# Altium schematic sheet device.SchDoc
size A2
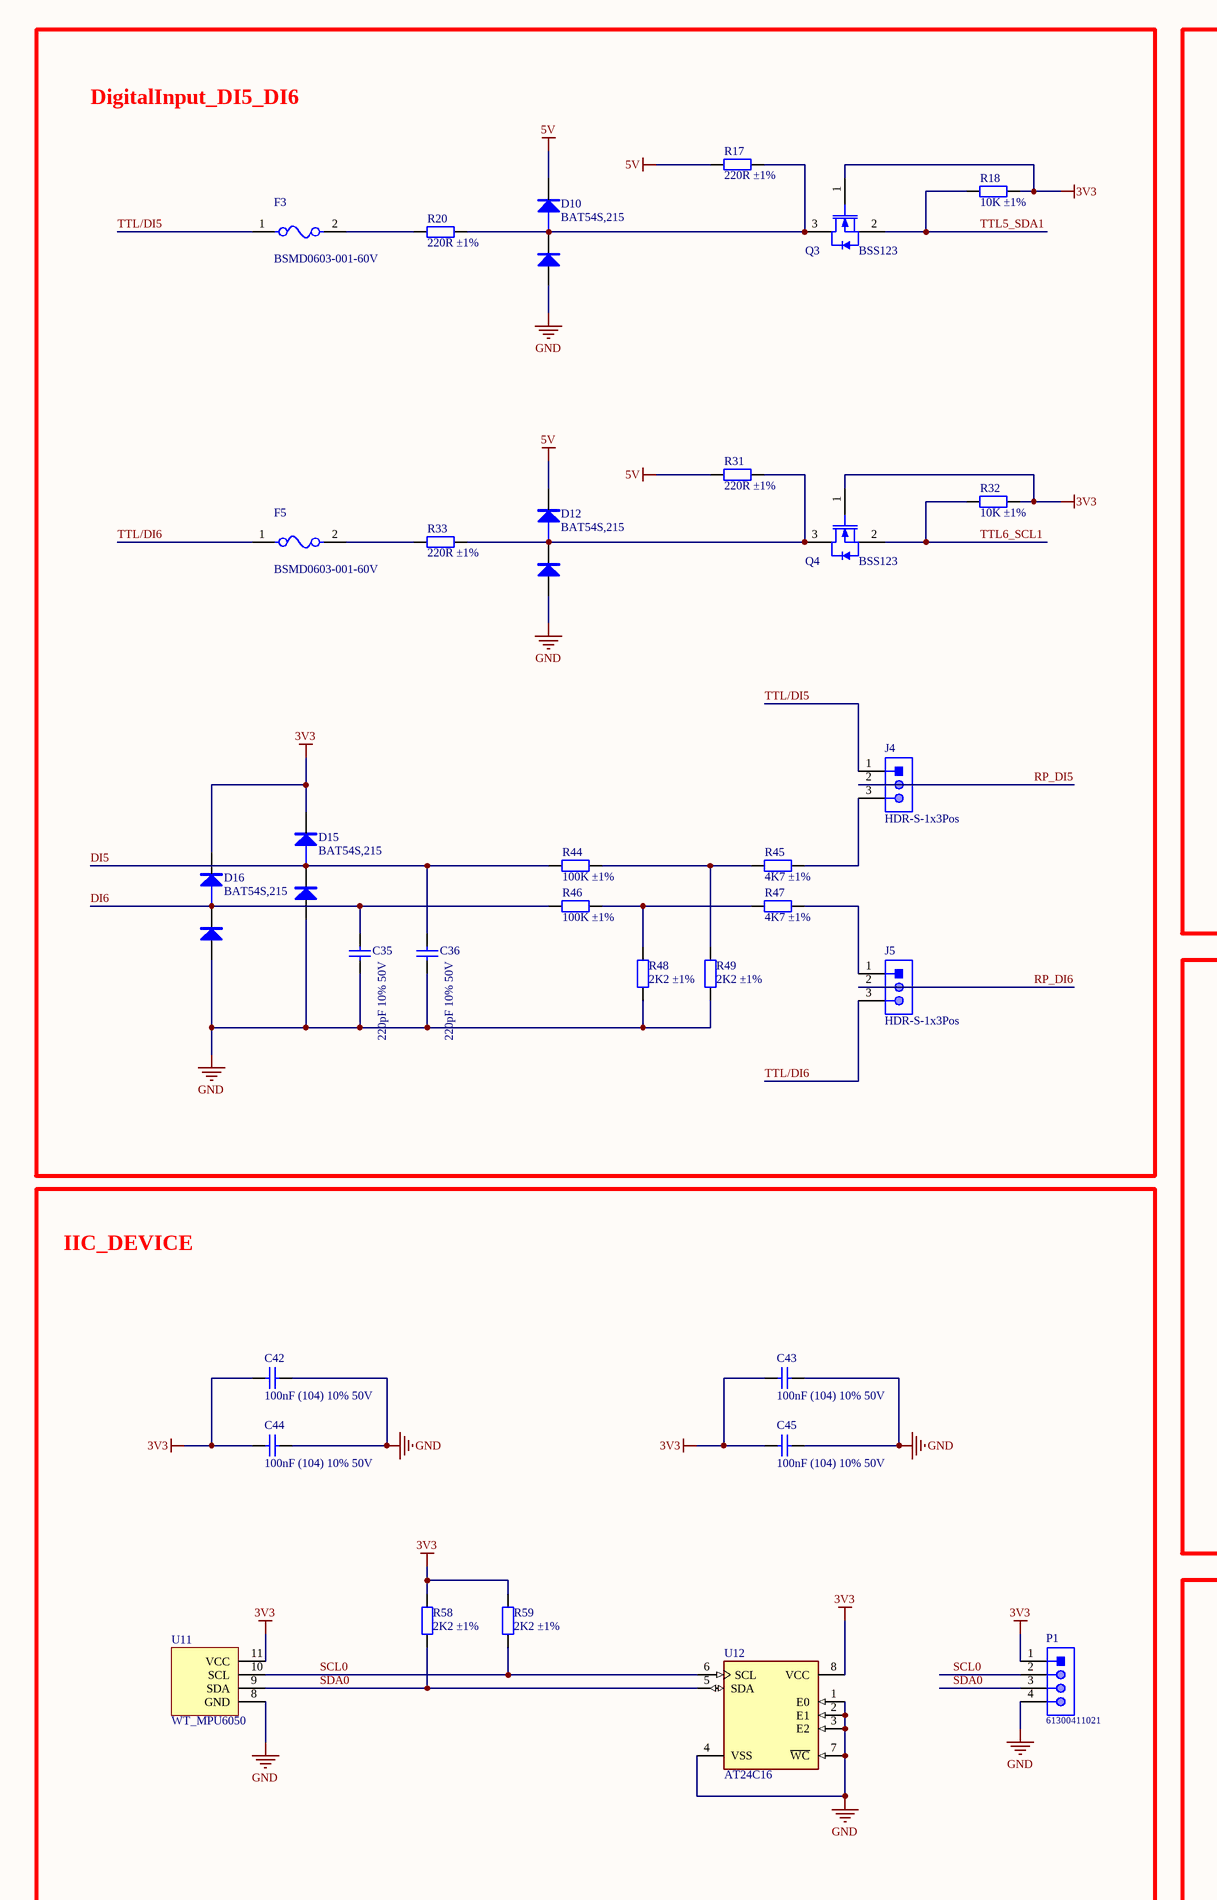
[diagram p0: device.SchDoc, left]
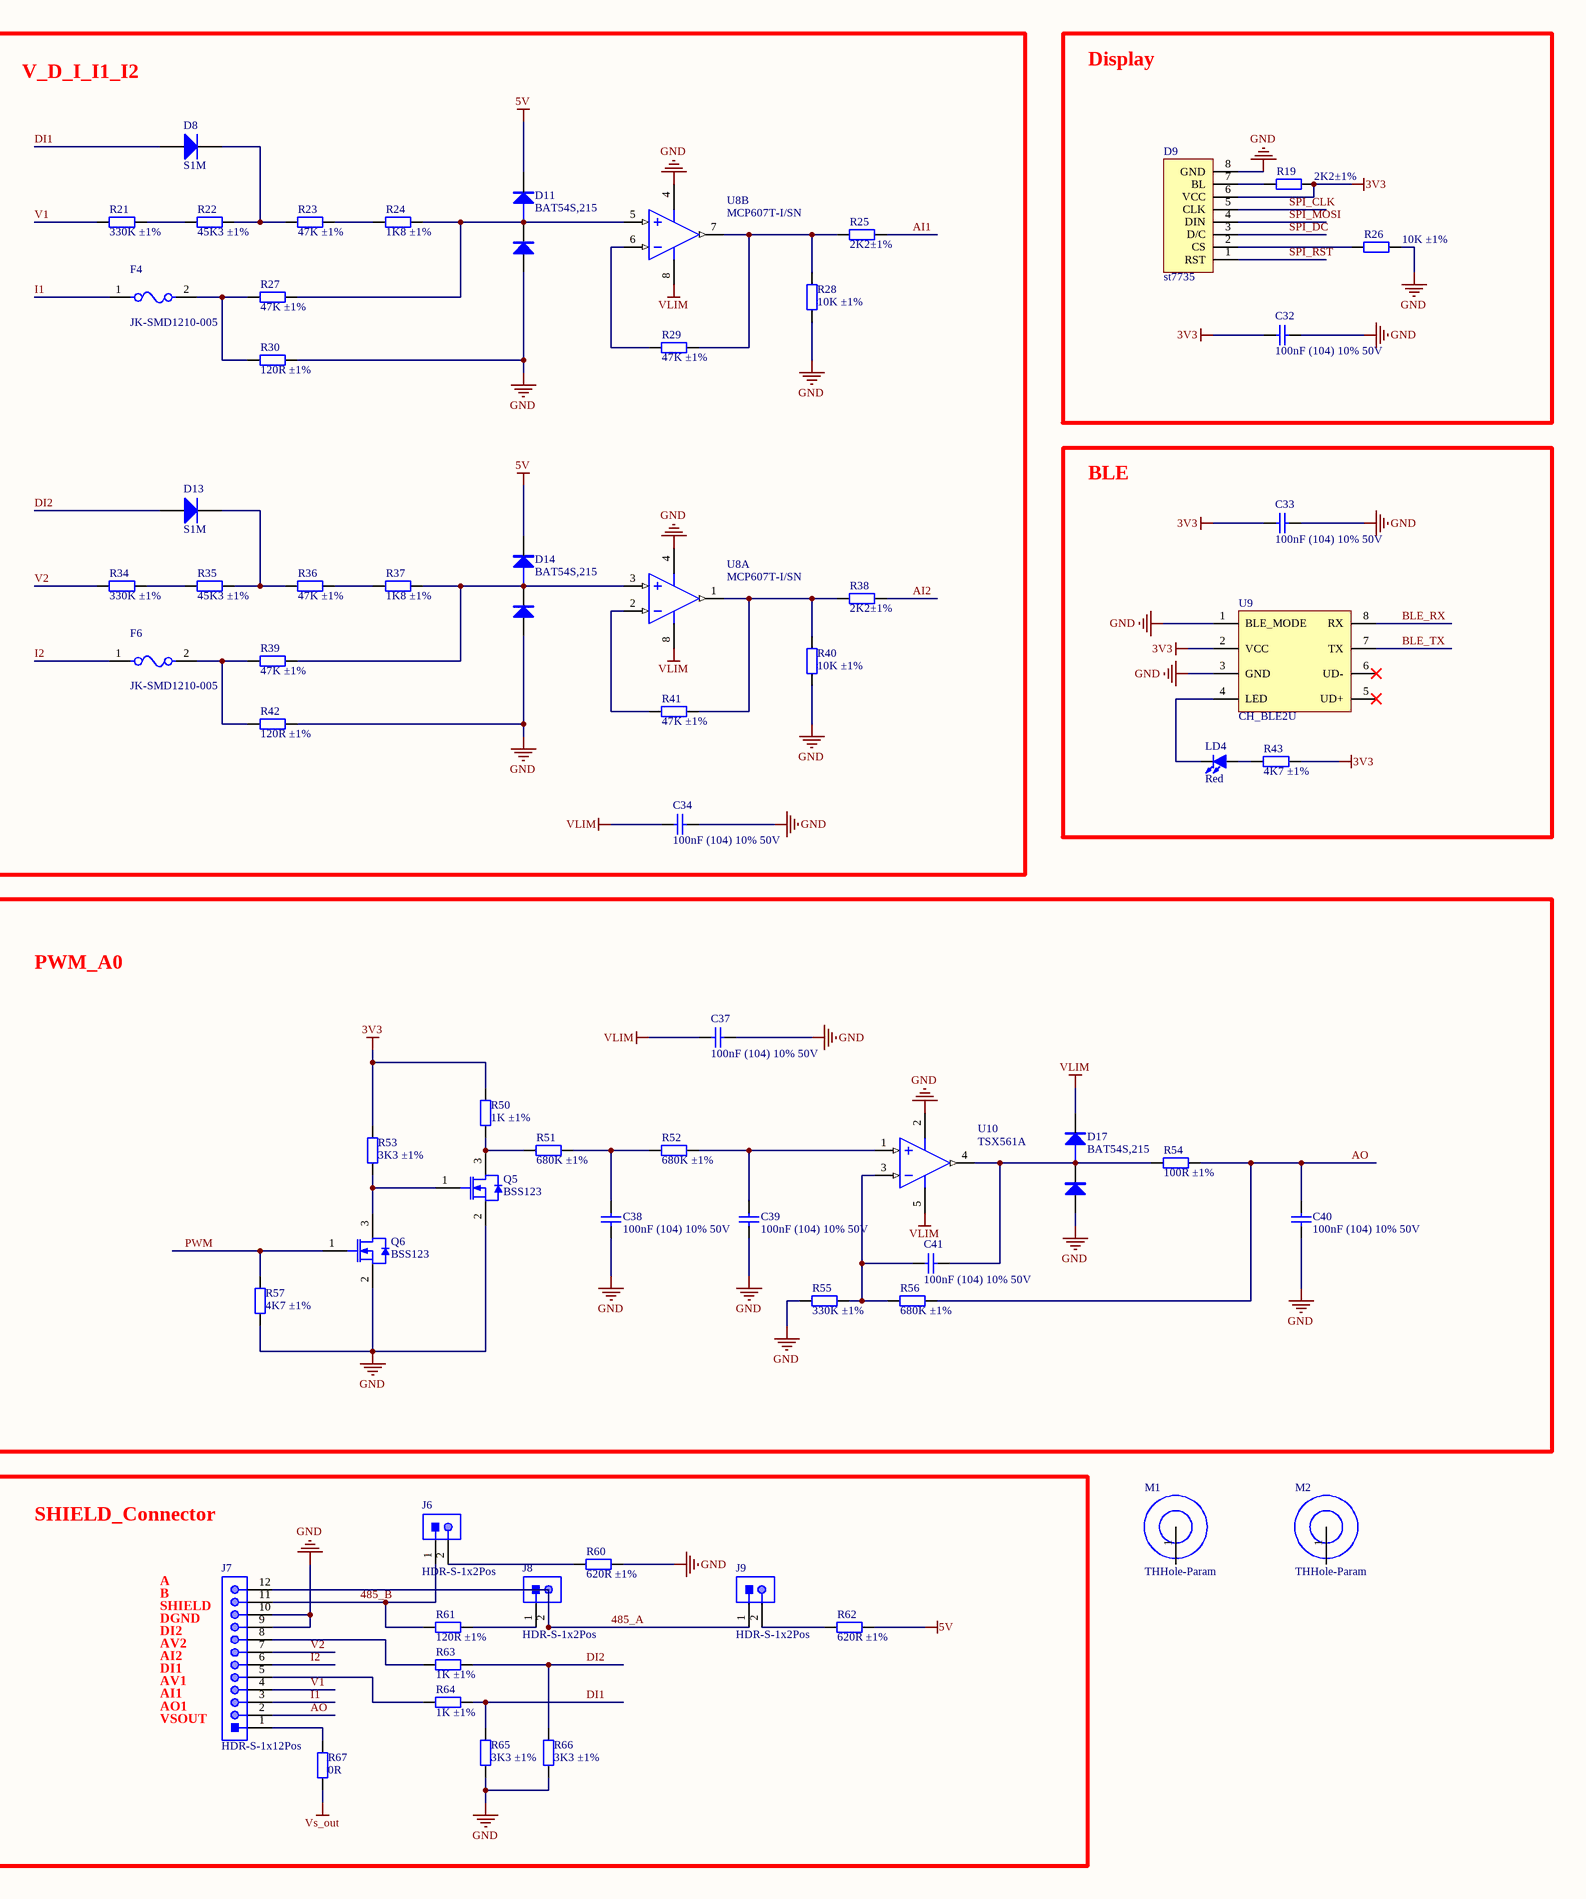
[diagram p1: device.SchDoc, right]

## Parts
C32  100nF (104) 10% 50V  [0402_C]
C33  100nF (104) 10% 50V  [0402_C]
C34  100nF (104) 10% 50V  [0402_C]
C35  220pF 10% 50V  [0402_C]
C36  220pF 10% 50V  [0402_C]
C37  100nF (104) 10% 50V  [0402_C]
C38  100nF (104) 10% 50V  [0402_C]
C39  100nF (104) 10% 50V  [0402_C]
C40  100nF (104) 10% 50V  [0402_C]
C41  100nF (104) 10% 50V  [0402_C]
C42  100nF (104) 10% 50V  [0402_C]
C43  100nF (104) 10% 50V  [0402_C]
C44  100nF (104) 10% 50V  [0402_C]
C45  100nF (104) 10% 50V  [0402_C]
D8  S1M  [DO-214AC]
D9  st7735  [HX-2.54-F-1x8-V]
D10  BAT54S,215  [SOT-23-3]
D11  BAT54S,215  [SOT-23-3]
D12  BAT54S,215  [SOT-23-3]
D13  S1M  [DO-214AC]
D14  BAT54S,215  [SOT-23-3]
D15  BAT54S,215  [SOT-23-3]
D16  BAT54S,215  [SOT-23-3]
D17  BAT54S,215  [SOT-23-3]
F3  BSMD0603-001-60V  [FU 0805]
F4  JK-SMD1210-005  [1210_R]
F5  BSMD0603-001-60V  [FU 0805]
F6  JK-SMD1210-005  [1210_R]
J4  HDR-S-1x3Pos  [HX-2.54-F-1x3-V]
J5  HDR-S-1x3Pos  [HX-2.54-F-1x3-V]
J6  HDR-S-1x2Pos  [Pin Header 1x2 TH Pitch 2.54mm]
J7  HDR-S-1x12Pos  [KF2EDGK-2.54-WI-12P]
J8  HDR-S-1x2Pos  [Pin Header 1x2 TH Pitch 2.54mm]
J9  HDR-S-1x2Pos  [Pin Header 1x2 TH Pitch 2.54mm]
LD4  Red  [0603_LED]
M1  THHole-Param  [MTG300_600]
M2  THHole-Param  [MTG300_600]
P1  61300411021  [HDR-2.54-1x4-H]
Q3  BSS123  [SOT95P245X110-3N]
Q4  BSS123  [SOT95P245X110-3N]
Q5  BSS123  [SOT95P245X110-3N]
Q6  BSS123  [SOT95P245X110-3N]
R17  220R ±1%  [0402_R]
R18  10K ±1%  [0402_R]
R19  2K2±1%  [0402_R]
R20  220R ±1%  [0402_R]
R21  330K ±1%  [0402_R]
R22  45K3 ±1%  [0402_R]
R23  47K ±1%  [0402_R]
R24  1K8 ±1%  [0402_R]
R25  2K2±1%  [0402_R]
R26  10K ±1%  [0402_R]
R27  47K ±1%  [0402_R]
R28  10K ±1%  [0402_R]
R29  47K ±1%  [0402_R]
R30  120R ±1%  [RS 1/4W-V3]
R31  220R ±1%  [0402_R]
R32  10K ±1%  [0402_R]
R33  220R ±1%  [0402_R]
R34  330K ±1%  [0402_R]
R35  45K3 ±1%  [0402_R]
R36  47K ±1%  [0402_R]
R37  1K8 ±1%  [0402_R]
R38  2K2±1%  [0402_R]
R39  47K ±1%  [0402_R]
R40  10K ±1%  [0402_R]
R41  47K ±1%  [0402_R]
R42  120R ±1%  [RS 1/4W-V3]
R43  4K7 ±1%  [0402_R]
R44  100K ±1%  [0402_R]
R45  4K7 ±1%  [0402_R]
R46  100K ±1%  [0402_R]
R47  4K7 ±1%  [0402_R]
R48  2K2 ±1%  [0402_R]
R49  2K2 ±1%  [0402_R]
R50  1K ±1%  [0402_R]
R51  680K ±1%  [0402_R]
R52  680K ±1%  [0402_R]
R53  3K3 ±1%  [0402_R]
R54  100R ±1%  [0603_R]
R55  330K ±1%  [0603_R]
R56  680K ±1%  [0603_R]
R57  4K7 ±1%  [0402_R]
R58  2K2 ±1%  [0402_R]
R59  2K2 ±1%  [0402_R]
R60  620R ±1%  [0603_R]
R61  120R ±1%  [0603_R]
R62  620R ±1%  [0603_R]
R63  1K ±1%  [0402_R]
R64  1K ±1%  [0402_R]
R65  3K3 ±1%  [0402_R]
R66  3K3 ±1%  [0402_R]
R67  0R  [1210_R]
U8  MCP607T-I/SN  [D0008A_L]  (parts A,B of 2)
U9  CH_BLE2U  [CH_BLE2U]
U10  TSX561A  [SOT-23-5]
U11  WT_MPU6050  [WT_MPU6050]
U12  AT24C16  [FP-SO8N-SO-A-IPC_A]

## Blocks framed on the sheet
DigitalInput_DI5_DI6: C35 C36 D10 D12 D15 D16 F3 F5 J4 J5 Q3 Q4 R17 R18 R20 R31-R33 R44-R49
V_D_I_I1_I2: C34 D8 D11 D13 D14 F4 F6 R21-R25 R27-R30 R34-R42 U8
Display: C32 D9 R19 R26
BLE: C33 LD4 R43 U9
PWM_A0: C37-C41 D17 Q5 Q6 R50-R57 U10
IIC_DEVICE: C42-C45 P1 R58 R59 U11 U12
SHIELD_Connector: J6-J9 R60-R67

## Nets
3V3: C32.1 C33.1 C42.1 C43.1 C44.1 C45.1 D9.6(VCC) D15.2 D16.2 P1.1 Q3.1(GATE) Q4.1(GATE) R18.1 R19.2 R32.1 R43.2 R50.1 R53.1 R58.1 R59.1 U9.2(VCC) U11.11(VCC) U12.8(VCC)
5V: D10.2 D11.2 D12.2 D14.2 R17.1 R31.1 R62.2
GND: C32.2 C33.2 C34.2 C35.1 C36.1 C37.2 C38.1 C39.1 C40.2 C42.2 C43.2 C44.2 C45.2 D9.8(GND) D10.1 D11.1 D12.1 D14.1 D15.1 D16.1 D17.1 J7.9 J7.10 P1.4 Q5.2(SOURCE) Q6.2(SOURCE) R26.2 R28.2 R30.1 R40.2 R42.1 R48.2 R49.2 R55.1 R57.2 R60.2 R65.1 R66.1 U8.4(GND) U9.1(BLE_MODE) U9.3(GND) U10.2(GND) U11.8(GND) U12.1(E0) U12.2(E1) U12.3(E2) U12.4(VSS) U12.7(~{WC})
VLIM: C34.1 C37.1 D17.2 U8.8(VCC) U10.5(VCC)
Vs_out: R67.1
485_A: J7.12 J8.2 J9.1
485_B: J6.1 J7.11 R61.1
AI1: R25.2
AI2: R38.2
AO: C40.1 J7.2 R54.2 R56.2
BLE_RX: U9.8(RX)
BLE_TX: U9.7(TX)
DI1: D8.2(A) R64.2 R65.2
DI2: D13.2(A) R63.2 R66.2
DI5: C36.2 D15.3 R44.1
DI6: C35.2 D16.3 R46.1
I1: F4.1 J7.3
I2: F6.1 J7.6
PWM: Q6.1(GATE) R57.1
RP_DI5: J4.2
RP_DI6: J5.2
SCL0: P1.2 R59.2 U11.10(SCL) U12.6(SCL)
SDA0: P1.3 R58.2 U11.9(SDA) U12.5(SDA)
SPI_CLK: D9.5(CLK)
SPI_DC: D9.3(D/C)
SPI_MOSI: D9.4(DIN)
SPI_RST: D9.1(RST)
TTL5_SDA1: Q3.2(SOURCE) R18.2
TTL6_SCL1: Q4.2(SOURCE) R32.2
TTL/DI5: F3.1 J4.1
TTL/DI6: F5.1 J5.3
V1: J7.4 R21.2
V2: J7.7 R34.2
NetC38_2: C38.2 R51.2 R52.1
NetC39_2: C39.2 R52.2 U10.1(IN+)
NetC41_1: C41.1 D17.3 R54.1 U10.4(OUT)
NetC41_2: C41.2 R55.2 R56.1 U10.3(IN-)
NetD8_1: D8.1(K) R22.1 R23.2
NetD9_2: D9.2(CS) R26.1
NetD9_7: D9.7(BL) R19.1
NetD10_3: D10.3 Q3.3(DRAIN) R17.2 R20.2
NetD11_3: D11.3 R24.1 R27.1 U8.5(2IN+)
NetD12_3: D12.3 Q4.3(DRAIN) R31.2 R33.2
NetD13_1: D13.1(K) R35.1 R36.2
NetD14_3: D14.3 R37.1 R39.1 U8.3(1IN+)
NetF3_2: F3.2 R20.1
NetF4_2: F4.2 R27.2 R30.2
NetF5_2: F5.2 R33.1
NetF6_2: F6.2 R39.2 R42.2
NetJ4_3: J4.3 R45.2
NetJ5_1: J5.1 R47.2
NetJ6_2: J6.2 R60.1
NetJ7_1: J7.1 R67.2
NetJ7_5: J7.5 R64.1
NetJ7_8: J7.8 R63.1
NetJ8_1: J8.1 R61.2
NetJ9_2: J9.2 R62.1
NetLD4_1: LD4.1(A) R43.1
NetLD4_2: LD4.2(K) U9.4(LED)
NetQ5_1: Q5.1(GATE) Q6.3(DRAIN) R53.2
NetQ5_3: Q5.3(DRAIN) R50.2 R51.1
NetR21_1: R21.1 R22.2
NetR23_1: R23.1 R24.2
NetR25_1: R25.1 R28.1 R29.1 U8.7(2OUT)
NetR29_2: R29.2 U8.6(2IN-)
NetR34_1: R34.1 R35.2
NetR36_1: R36.1 R37.2
NetR38_1: R38.1 R40.1 R41.1 U8.1(1OUT)
NetR41_2: R41.2 U8.2(1IN-)
NetR44_2: R44.2 R45.1 R49.1
NetR46_2: R46.2 R47.1 R48.1

Not connected (* = marked no-connect by the designer): M1 1; M2 1; U9 5(UD+)* 6(UD-)*

## Notes on the sheet
- A
- B
- (near J7) SHIELD
- DGND
- DI2
- AV2
- AI2
- DI1
- AV1
- AI1
- AO1
- VSOUT

## Library data of the parts
C32-C34 C37-C45 = 0402 100nF (104) 10% 16V: 贴片电容; ComponentLink1Description: 供应商链接; ComponentLink1URL: http://www.szlcsc.com/product/details_1877.html; Package: 0402; Supplier: LC; SuppliersPartNumber: C1525
C35 C36 = 0402 150pF (151) 10% 50V: 贴片电容; ComponentLink1Description: 供应商链接; ComponentLink1URL: http://www.szlcsc.com/product/details_1879.html; Package: 0402; Supplier: LC; SuppliersPartNumber: C1527
D8 D13 = B5817WS-TP: 肖特基二极管; Manufacturer: MCC; Forward Voltage: 450mV; Max Reverse Current: 1mA; Average Rectified Current: 1A; Max Repetitive Reverse Voltage (Vrrm): 20V; Max Forward Surge Current (Ifsm): 10A; Element Configuration: Single; Supplier 1: Digi-Key; Manufacturer Part Number: B5817WS-TP; RoHS: Yes; Category: Rectifier Diodes; Stock 1: 47317; Pricing 1: 1=0.43000, 10=0.30300, 100=0.15310, 500=0.12486, 1000=0.09264 (USD); Mount: Surface Mount; Number of Pins: 2; Max Operating Temperature: 125°C; Packaging: Tape and Reel; Package Quantity: 1; Forward Current: 1A; Max Reverse Voltage (DC): 20V; REACH SVHC: Unknown; Lead Free: Lead Free; RoHS Compliant: Yes; ComponentLink1URL: https://datasheet.ciiva.com/912/b5817ws-b5819wssod-323-912713.pdf?src-supplier=Digi-Key; ComponentLink1Description: https://datasheet.ciiva.com/912/b5817ws-b5819wssod-323-912713.pdf?src-supplier=Digi-Key; ComponentLink2URL: https://datasheet.ciiva.com/7624/b5817ws-b5819wssod-323-7624698.pdf?src-supplier=Element14; ComponentLink2Description: https://datasheet.ciiva.com/7624/b5817ws-b5819wssod-323-7624698.pdf?src-supplier=Element14; ComponentLink3URL: https://datasheet.ciiva.com/912/b5817ws-b5819wssod-323-912711.pdf?src-supplier=Digi-Key; ComponentLink3Description: https://datasheet.ciiva.com/912/b5817ws-b5819wssod-323-912711.pdf?src-supplier=Digi-Key; ComponentLink4URL: https://datasheet.ciiva.com/912/b5817ws-b5819wssod-323-912712.pdf?src-supplier=Digi-Key; ComponentLink4Description: https://datasheet.ciiva.com/912/b5817ws-b5819wssod-323-912712.pdf?src-supplier=Digi-Key; ComponentLink5URL: https://datasheet.ciiva.com/17182/b5817ws-b5819wssod-323-17182367.pdf?src-supplier=Future+Electronics; ComponentLink5Description: https://datasheet.ciiva.com/17182/b5817ws-b5819wssod-323-17182367.pdf?src-supplier=Future+Electronics; Supplier Part Number 1: B5817WS-TPMSCT-ND
D10-D12 D14-D17 = BAT54S,215: 肖特基二极管
F3-F6 = Fuse 2A 0805: 贴片保险，自恢复
J4 J5 = HDR-S-1x3Pos: 2.54mm 排座
J6 J8 J9 = HDR-S-1x2Pos: 2.54mm 排座
J7 = HDR-S-1x12Pos: 2.54mm 排座
LD4 = LED: 贴片LED; 版权归属: 源创客; BOM名称: 贴片LED; 学习资源: www.ooocke.com
M1 M2 = MHole-1: 金属化可接地固定孔
P1 = HDR-1x4Pos: 2.54mm 排针; Manufacturer: Wurth Elektronik; Gender: Male; Pin Number: 4; Withstanding Voltage: 500VAC; Row Number: Single; Working Voltage: 250VAC; Contact Resistance: 20mOhm; Rated Current: 3A; Manufacturer URL: http://www.we-online.de; Mounting Technology: THT; Publisher: WurthElektronik; Operating Temperature: -40to105degC; Packaging: Bag; Package Reference: 61300411021; Part Number: 61300411021; Orientation: Angled; Pitch: 2.54mm; Datasheet URL: https://katalog.we-online.de/em/datasheet/6130xx11021.pdf
Q3-Q6 = 2N7002: Trans Mosfet N-ch 60V 0.115A 3-PIN SOT-23 T/r; Manufacturer: Infineon; Rds On Max: 3R; Continuous Drain Current (ID): 300mA; Input Capacitance: 13pF; Max Power Dissipation: 500mW; Element Configuration: Single; Drain to Source Resistance: 4R; Gate to Source Voltage (Vgs): 20V; Turn-Off Delay Time: 5.5ns; Turn-On Delay Time: 3ns; Supplier 1: Digi-Key; Manufacturer Part Number: 2N7002; RoHS: Yes; Category: MOSFETs; Stock 1: 36038; Pricing 1: 1=0.29000, 10=0.23500, 25=0.19720, 100=0.09640, 250=0.09484, 500=0.08038, 1000=0.05585 (USD); Case/Package: SOT-23; Number of Pins: 3; Min Operating Temperature: -55°C; Max Operating Temperature: 150°C; Packaging: Tape and Reel; Drain to Source Voltage (Vdss): 60V; Max Dual Supply Voltage: 60V; Length: 2.9mm; Height: 1mm; Width: 1.3mm; Halogen Free: Halogen Free; ComponentLink1URL: http://uk.rs-online.com/webdocs/1073/0900766b81073ec5.pdf?src-supplier=RSComponents; ComponentLink1Description: http://uk.rs-online.com/webdocs/1073/0900766b81073ec5.pdf?src-supplier=RSComponents; Supplier Part Number 1: 2N7002H6327XTSA2CT-ND
R17-R42 R44-R67 = 0402 1.2KΩ (1201) 1%: 贴片电阻; ComponentLink1Description: 供应商链接; ComponentLink1URL: http://www.szlcsc.com/product/details_26605.html; Package: 0402; Supplier: LC; SuppliersPartNumber: C25862
R43 = 0402 100KΩ (1003) 1%: 贴片电阻; ComponentLink1Description: 供应商链接; ComponentLink1URL: http://www.szlcsc.com/product/details_26484.html; Package: 0402; Supplier: LC; SuppliersPartNumber: C25741
U8 = TI-LM358DR: Dual Operational Amplifier, 3 to 32 V, 0 to 70 degC, 8-Pin SOIC (D), Green (RoHS & no Sb/Br), Tape and Reel; DatasheetVersion: SLOS068T, 04/2015; ComponentLink1URL: http://www.ti.com/; ComponentLink2URL: http://www.ti.com/lit/ds/symlink/lm358.pdf; ComponentLink3Description: Package Specification; Code_JEDEC: MS-012; PackageDescription: 8-Pin Small Outline Integrated Circuit, Body 4.9 x 3.9 mm, Pitch 1.27 mm; ComponentLink2Description: Datasheet; PackageVersion: 4040047-3/M, 06/2011; ComponentLink1Description: Manufacturer URL; ComponentLink3URL: http://www.ti.com/lit/ml/msoi002j/msoi002j.pdf; PackageReference: D0008A
U9 = CH_BLE2U: BLE模块
U12 = ST-M24C02-WMN6TP: IC EEPROM 2K I2C 400KHZ 8SO; Manufacturer: STMicroelectronics; Min Supply Voltage: 2.5V; Standoff Height: 0.1mm; Nominal Supply Current: 0.5-1mA; Access Time: 900ns; Memory Size: 2Kbits; Max Supply Voltage: 5.5V; Digikey Description: IC EEPROM 2K I2C 400KHZ 8SO; Memory Type: EEPROM; ComponentLink2URL: https://www.st.com/resource/en/datasheet/m24c02-w.pdf; Device Class L3: EEPROM; Interface: I2C; Temperature Range High: +85°C; Mouser Description: M24C02 Series 2 Kb (256 x 8) 2.5 V SMT Serial I²C Bus EEPROM - SOIC-8; RoHS: TRUE; Lead Free: Yes; Ambient Temperature Range Low: -40°C; Temperature: -40°C to +85°C; Device Class L1: Integrated Circuits (ICs); Temperature Range Low: -40°C; Frequency: 400kHz; Category: IC; Manufacturer Part Number: M24C02-WMN6TP; Height: 1.75mm; Octopart: https://octopart.com/m24c02-wmn6tp-stmicroelectronics-55404516; Automotive: No; Ambient Temperature Range High: +85°C; ComponentLink2Description: Datasheet; Package: SO8N-SO-A; Device Class L2: Memory